# EAGLE design i-oboard (EAGLE 9.6.2)
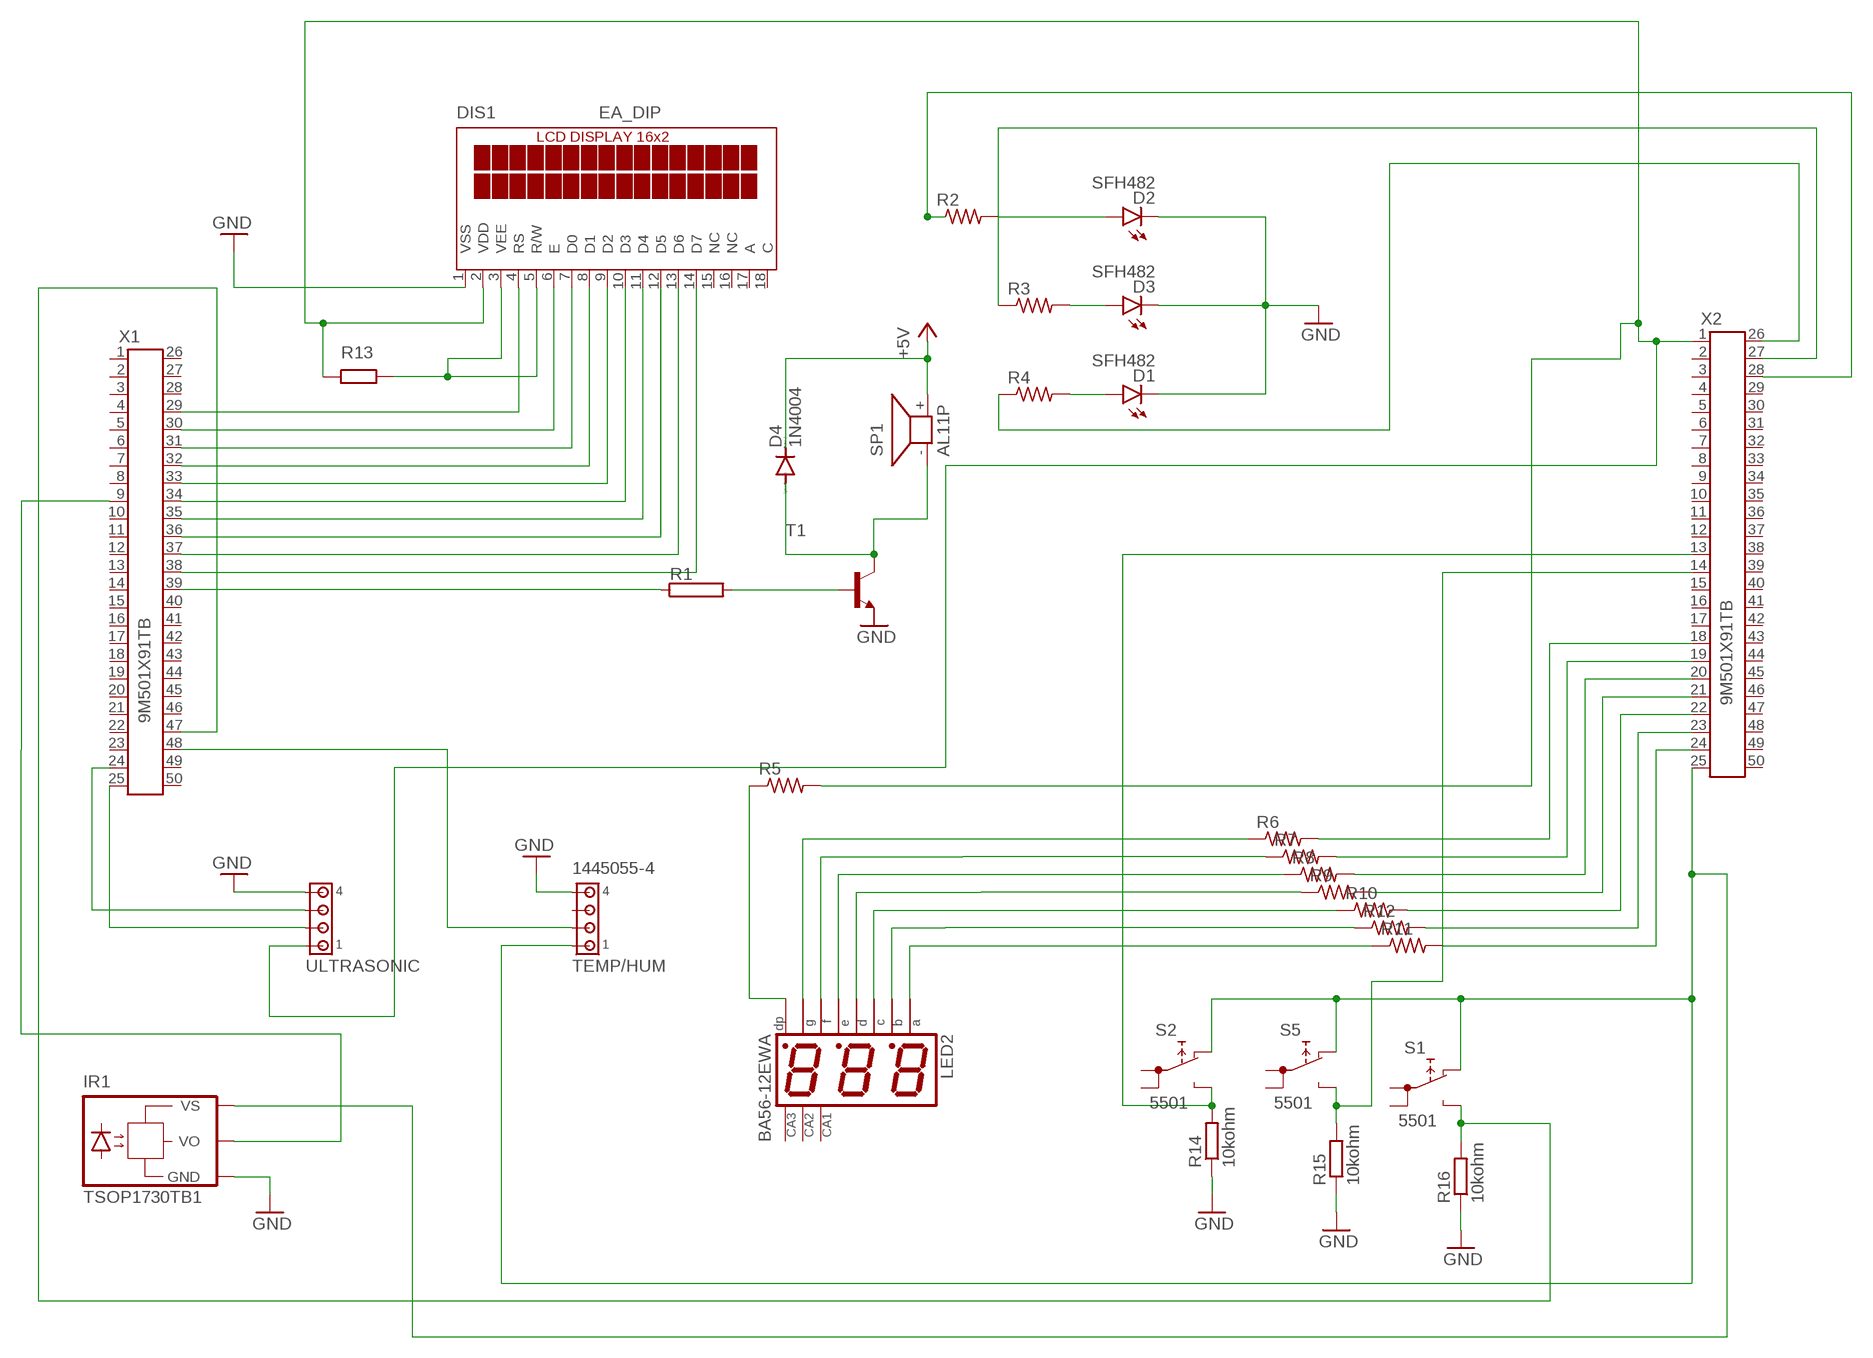
[diagram p0: schematic, sheet 1]

## Parts
D1  SFH482  [SFH482]
D2  SFH482  [SFH482]
D3  SFH482  [SFH482]
D4  1N4004  [DO41-10]
DIS1  EA_DIP  [EA_DIP]
IR1  TSOP1730TB1  [TSOP17_TB1]
LED2  BA56-12EWA  [BX56-12]
R1  RAC01  [AC01]
R2  R-US_0204/2V  [0204V]
R3  R-US_0204/2V  [0204V]
R4  R-US_0204/2V  [0204V]
R5  R-US_0204/2V  [0204V]
R6  R-US_0204/2V  [0204V]
R7  R-US_0204/2V  [0204V]
R8  R-US_0204/2V  [0204V]
R9  R-US_0204/2V  [0204V]
R10  R-US_0204/2V  [0204V]
R11  R-US_0204/2V  [0204V]
R12  R-US_0204/2V  [0204V]
R13  R  (no package)
R14  10kohm  R-EU_0204/2V  [0204V]
R15  10kohm  R-EU_0204/2V  [0204V]
R16  10kohm  R-EU_0204/2V  [0204V]
S1  5501  [5501]
S2  5501  [5501]
S5  5501  [5501]
SP1  AL11P  [AL11P]
T1  -NPN-SOT23-EBC  [SOT23-EBC]
TEMP/HUM  1445055-4  [1445055-4]
ULTRASONIC  1445055-4  [1445055-4]
X1  9M501X91TB  [9M501X91]
X2  9M501X91TB  [9M501X91]

## Nets
+5V: D4.C SP1.+
GND: D1.K(C) D2.K(C) D3.K(C) DIS1.1(VSS) IR1.GND R14.1 R15.1 R16.1 TEMP/HUM.4 ULTRASONIC.4
N$1: LED2.5(G) R6.1
N$2: DIS1.7(D0) X1.31
N$3: DIS1.8(D1) X1.32
N$4: DIS1.9(D2) X1.33
N$5: DIS1.10(D3) X1.34
N$6: DIS1.11(D4) X1.35
N$7: DIS1.12(D5) X1.36
N$8: DIS1.13(D6) X1.37
N$9: D4.A SP1.- T1.C
N$10: DIS1.14(D7) X1.38
N$11: DIS1.6(E) X1.30
N$12: DIS1.4(RS) X1.29
N$13: DIS1.3(VEE) DIS1.5(R/W) R13.2
N$14: R1.2 T1.B
N$15: R1.1 X1.39
N$16: R4.1 X2.26
N$17: R3.1 X2.27
N$18: D2.A R2.2
N$19: D3.A R3.2
N$20: D1.A R4.2
N$21: R11.2 X2.24
N$22: R12.2 X2.23
N$23: R10.2 X2.22
N$24: R9.2 X2.21
N$25: R8.2 X2.20
N$26: R7.2 X2.19
N$27: R6.2 X2.18
N$28: LED2.3(DP) R5.1
N$29: LED2.10(F) R7.1
N$30: ULTRASONIC.2 X1.25
N$31: DIS1.2(VDD) R5.2 R13.1 ULTRASONIC.1 X2.1
N$32: LED2.1(E) R8.1
N$33: LED2.2(D) R9.1
N$34: LED2.4(C) R10.1
N$35: LED2.7(B) R12.1
N$36: LED2.11(A) R11.1
N$37: ULTRASONIC.3 X1.24
N$38: R15.2 S5.NO X2.14
N$39: R2.1 X2.28
N$40: TEMP/HUM.2 X1.48
N$41: IR1.VS S1.NC S2.NC S5.NC TEMP/HUM.1 X2.25
N$42: R14.2 S2.NO X2.13
N$43: R16.2 S1.NO X1.47
N$45: IR1.VO X1.9
Unconnected: DIS1.15(NC) DIS1.16(NC) DIS1.17(A) DIS1.18(C) LED2.8(CA) LED2.9(CA) LED2.12(CA) S1.1A S1.1B S2.1A S2.1B S5.1A S5.1B T1.E TEMP/HUM.3 X1.1 X1.2 X1.3 X1.4 X1.5 X1.6 X1.7 X1.8 X1.10 X1.11 X1.12 X1.13 X1.14 X1.15 X1.16 X1.17 X1.18 X1.19 X1.20 X1.21 X1.22 X1.23 X1.26 X1.27 X1.28 X1.40 X1.41 X1.42 X1.43 X1.44 X1.45 X1.46 X1.49 X1.50 X2.2 X2.3 X2.4 X2.5 X2.6 X2.7 X2.8 X2.9 X2.10 X2.11 X2.12 X2.15 X2.16 X2.17 X2.29 X2.30 X2.31 X2.32 X2.33 X2.34 X2.35 X2.36 X2.37 X2.38 X2.39 X2.40 X2.41 X2.42 X2.43 X2.44 X2.45 X2.46 X2.47 X2.48 X2.49 X2.50

## Library data of the parts
D1-D3 = led:SFH482: IR LED infrared emitting diode, Infineon
D4 = diode:1N4004: DIODE general purpose rectifier, 1 A
DIS1 = display-lcd:EA_DIP: LCD-MODUL 2x16 - 6,68mm, INKL. KONTROLLER HD44780 Source: Data sheet <http://www.lcd-module.de/pdf/doma/dip162-d.pdf>
IR1 = telefunken:TSOP17*TB1: TSOP17..TB1 IR Receiver Modules for Remote Control Systems Source: http://www.vishay.com/docs/82042/82042.pdf; OC_FARNELL: unknown; OC_NEWARK: unknown
LED2 = display-kingbright:B?56-12*WA: 14.22mm (0.56INCH) THREE DIGIT NUMERIC DISPLAY Source: http://www.kingbright.com .. BA56-11EWA(Ver1189474895.pdf; OC_FARNELL: unknown; OC_NEWARK: unknown
R1 = resistor-power:R: Power Resitor; OC_FARNELL: unknown; OC_NEWARK: unknown
R2-R12 = rcl:R-US_: RESISTOR, American symbol; SPICEPREFIX: R
R13 = ngspice-simulation:R: RESISTOR
R14-R16 = rcl:R-EU_: RESISTOR, European symbol; SPICEPREFIX: R
S1 S2 S5 = switch:55?: PUSHBUTTON SERIES 5500 SWITCHES Source: www.e-switch.com .. 5500.pdf
SP1 = buzzer:AL11P: SPEAKER Source: Buerklin; OC_FARNELL: unknown; OC_NEWARK: unknown
T1 = transistor-neu-to92:*-NPN-: NPN Transistror
TEMP/HUM ULTRASONIC = con-amp:1445055-4: Micro MATE-N-LOK Connectors grid 1.5 mm Source: ENG_CD_1445055_A.pdf
X1 X2 = con-3m:9M501X91TB: CONNECTOR PCMCIA-CompactFlash; OC_FARNELL: unknown; OC_NEWARK: unknown

## Board
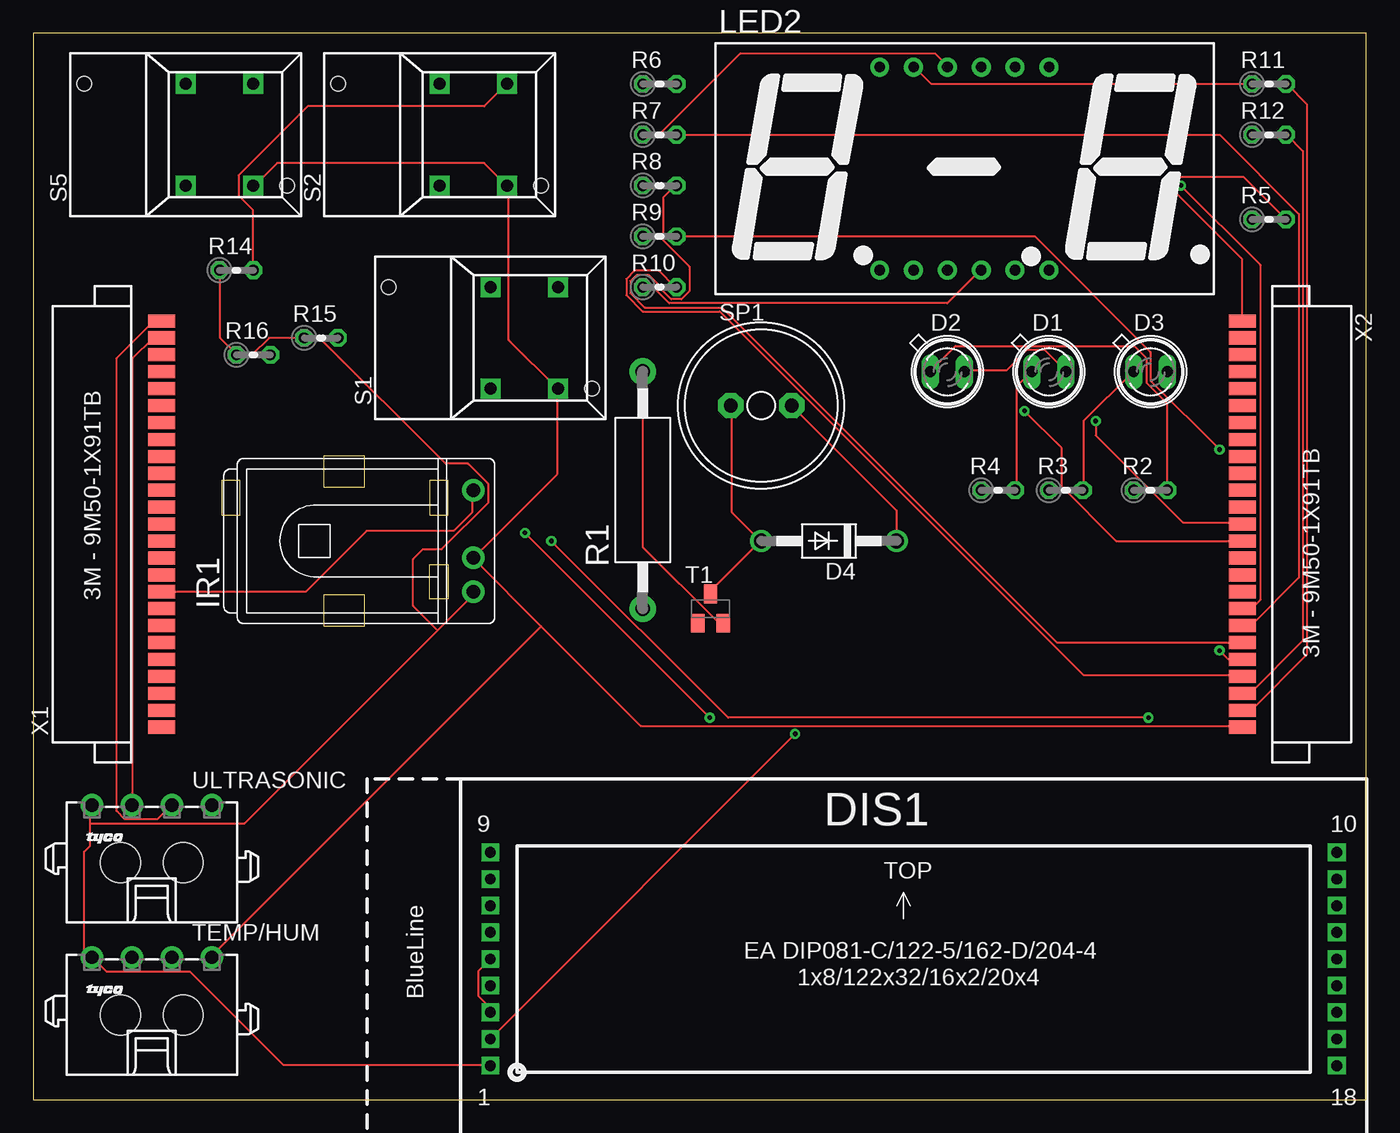
[diagram p1: board, top side]
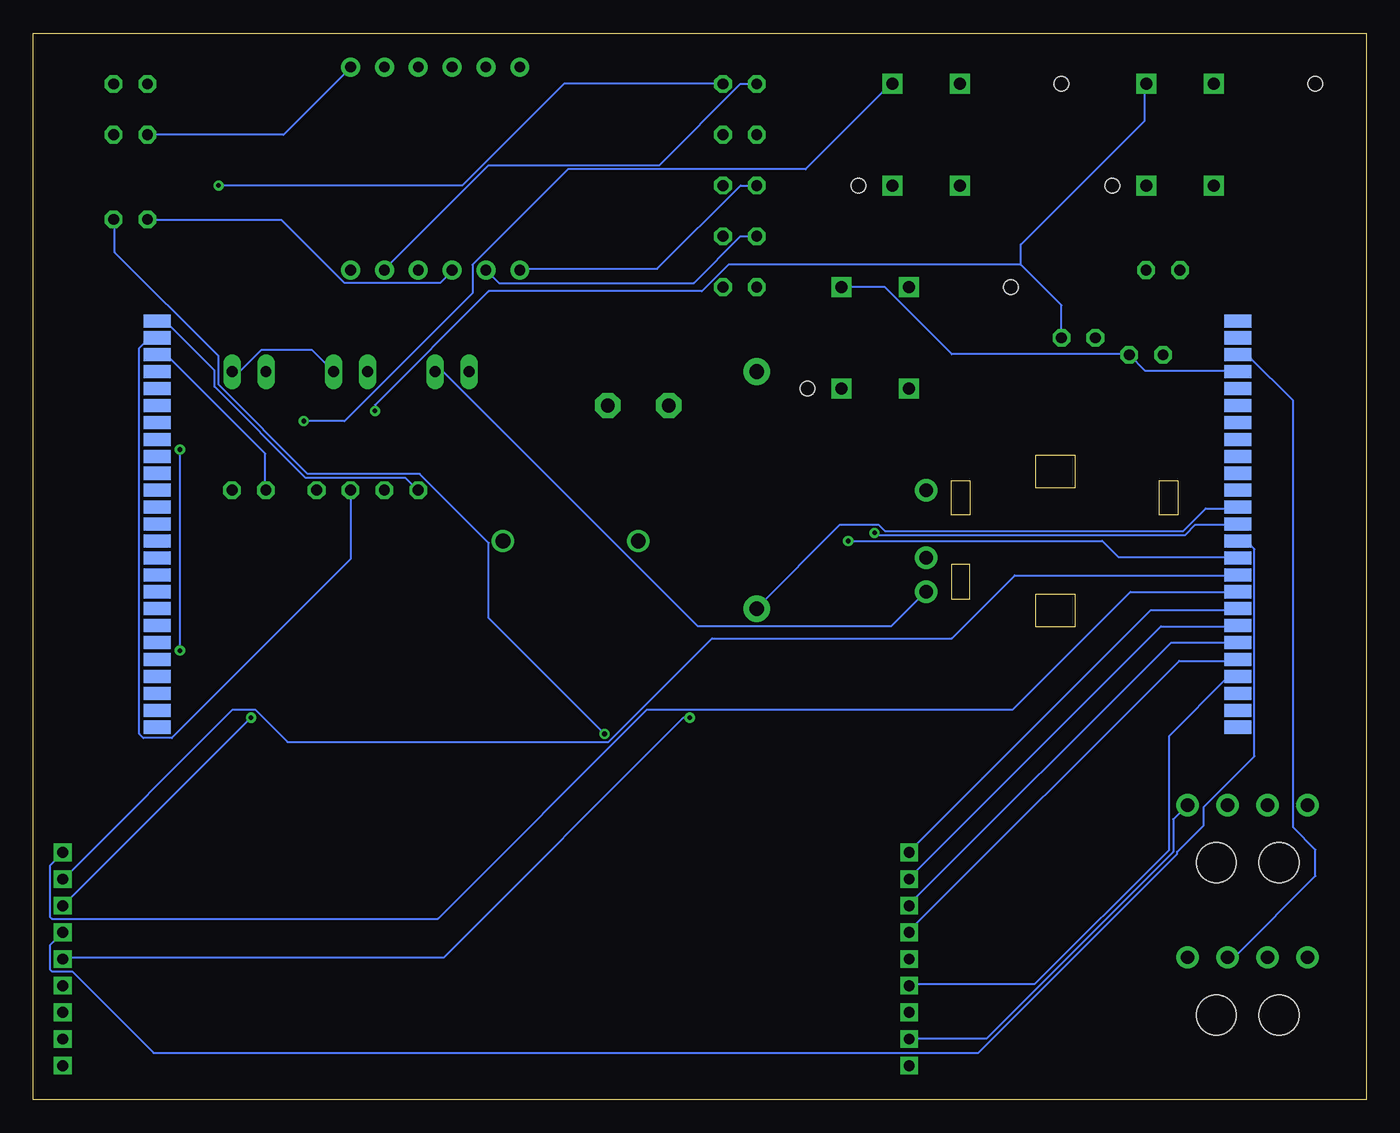
[diagram p2: board, bottom side, seen from below]

Size 100 x 80 mm. Coordinates in mm from the lower left corner, seen from the top.
Outline: 0,0 100,0 100,80 0,80 0,0
Copper layers (1*16): Top 0.035mm / dielectric 1.5mm / Bottom 0.035mm
Design rules "default": minimum track width 6mil, minimum drill 0.35mm, track to track 6mil, track to pad 6mil, pad to pad 6mil, via to via 6mil, smd to smd 6mil, copper to edge 40mil, drill to drill 6mil, minimum pad ring 10mil, minimum via ring 8mil, stop-mask expansion 4mil, vias tented up to drill 0mil, thermal gap 10mil

### Footprints (pad centres in the part's own frame; a part is rotated, then mirrored left to right if it is on the bottom)
SFH482 = drill 0.813 long: A -1.27,0; K 1.27,0
DO41-10 = drill 1.118: A 5.08,0; C -5.08,0
EA_DIP = drill 0.813 pad 1.27 square: 1 0,0; 2 0,2; 3 0,4; 4 0,6; 5 0,8; 6 0,10; 7 0,12; 8 0,14; 9 0,16; 10 63.5,16; 11 63.5,14; 12 63.5,12; 13 63.5,10; 14 63.5,8; 15 63.5,6; 16 63.5,4; 17 63.5,2; 18 63.5,0
TSOP17_TB1 = drill 1 pad 1.676: GND 0,-3.81; VO 0,3.81; VS 0,-1.27
BX56-12 = drill 0.8 pad 1.422: 1 -6.35,-7.62; 2 -3.81,-7.62; 3 -1.27,-7.62; 4 1.27,-7.62; 5 3.81,-7.62; 6 6.35,-7.62; 7 6.35,7.62; 8 3.81,7.62; 9 1.27,7.62; 10 -1.27,7.62; 11 -3.81,7.62; 12 -6.35,7.62
AC01 = drill 1.1 pad 2: 1 -8.9,0; 2 8.9,0
0204V = drill 0.813 octagon: 1 -1.27,0; 2 1.27,0
5501 = drill 0.9 pad 1.5 square: 1A 0,3.81; 1B 0,-3.81; NC 5.08,-3.81; NO 5.08,3.81 | hole 1.1: -7.62,3.81; 7.62,-3.81
AL11P = drill 1.016 pad 1.905 octagon: + 2.286,0; - -2.286,0
SOT23-EBC = smd 1 x 1.4: B 0.95,-1.1; C 0,1.1; E -0.95,-1.1
1445055-4 = drill 1 pad 1.676: 1 4.5,4.32; 2 1.5,4.32; 3 -1.5,4.32; 4 -4.5,4.32 | hole 3: -2.35,0; 2.35,0
9M501X91 = smd 0.98 x 2.03: 1 -15.24,-3.29; 2 -13.97,-3.29; 3 -12.7,-3.29; 4 -11.43,-3.29; 5 -10.16,-3.29; 6 -8.89,-3.29; 7 -7.62,-3.29; 8 -6.35,-3.29; 9 -5.08,-3.29; 10 -3.81,-3.29; 11 -2.54,-3.29; 12 -1.27,-3.29; 13 0,-3.29; 14 1.27,-3.29; 15 2.54,-3.29; 16 3.81,-3.29; 17 5.08,-3.29; 18 6.35,-3.29; 19 7.62,-3.29; 20 8.89,-3.29; 21 10.16,-3.29; 22 11.43,-3.29; 23 12.7,-3.29; 24 13.97,-3.29; 25 15.24,-3.29 | smd 0.98 x 2.03 bottom: 26 -15.24,-3.29; 27 -13.97,-3.29; 28 -12.7,-3.29; 29 -11.43,-3.29; 30 -10.16,-3.29; 31 -8.89,-3.29; 32 -7.62,-3.29; 33 -6.35,-3.29; 34 -5.08,-3.29; 35 -3.81,-3.29; 36 -2.54,-3.29; 37 -1.27,-3.29; 38 0,-3.29; 39 1.27,-3.29; 40 2.54,-3.29; 41 3.81,-3.29; 42 5.08,-3.29; 43 6.35,-3.29; 44 7.62,-3.29; 45 8.89,-3.29; 46 10.16,-3.29; 47 11.43,-3.29; 48 12.7,-3.29; 49 13.97,-3.29; 50 15.24,-3.29

### Placement (x,y rotation side)
D1  76.2,54.61 0 top
D2  68.58,54.61 0 top
D3  83.82,54.61 0 top
D4  59.69,41.91 180 top
DIS1  34.29,2.54 0 top
IR1  33.02,41.91 0 top
LED2  69.85,69.85 0 top
R1  45.72,45.72 90 top
R2  83.82,45.72 0 top
R3  77.47,45.72 0 top
R4  72.39,45.72 0 top
R5  92.71,66.04 0 top
R6  46.99,76.2 0 top
R7  46.99,72.39 0 top
R8  46.99,68.58 0 top
R9  46.99,64.77 0 top
R10  46.99,60.96 0 top
R11  92.71,76.2 0 top
R12  92.71,72.39 0 top
R14  15.24,62.23 0 top
R15  21.59,57.15 0 top
R16  16.51,55.88 0 top
S1  34.29,57.15 0 top
S2  30.48,72.39 0 top
S5  11.43,72.39 0 top
SP1  54.61,52.07 0 top
T1  50.8,36.83 0 top
TEMP/HUM  8.89,6.35 0 top
ULTRASONIC  8.89,17.78 0 top
X1  6.35,43.18 90 top
X2  93.98,43.18 270 top

### Tracks (layer width: path | path; a pad name or v marks a point on that pad's centre or on a via)
+5V
  Top 0.152: D4.C 64.77,44.2 SP1.+
GND
  Top 0.152: D2.K 69.95,54.71 73,54.71 74.52,56.24 75.89,56.24 77.42,54.71 D1.K | 15.24,55.93 16.46,55.93 17.68,57.15 R15.1 21.49,57.15 30.94,47.7 32.61,47.7 34.14,46.18 34.14,44.81 30.63,41.3 29.26,41.3 28.5,40.54 28.5,37.03 30.33,35.2 | 15.24,55.93 14.02,57.15 14.02,62.18 R14.1 | 15.24,55.93 R16.1 | DIS1.1 34.29,2.59 18.75,2.59 11.73,9.6 5.49,9.6 4.42,10.67 TEMP/HUM.4 4.27,10.82 3.81,11.28 3.81,18.59 4.27,19.05 4.27,20.73 | 4.27,20.73 4.27,22.1 ULTRASONIC.4 | 30.33,35.2 15.85,20.73 4.27,20.73 | 30.33,35.2 32.92,37.8 32.92,38.1 IR1.GND
  Bottom 0.152: D1.K 79.1,56.24 82.91,56.24 84.43,54.71 85.04,54.71 D3.K | D2.K 69.8,54.56 69.19,54.56 50.14,35.51 35.66,35.51 33.07,38.1 IR1.GND
N$1
  Bottom 0.152: R6.1 46.94,76.2 53.03,70.1 65.84,70.1 73.61,62.33 LED2.5
N$2
  Bottom 0.152: X1.31 14.63,34.29 34.29,14.63 DIS1.7
N$3
  Bottom 0.152: X1.32 9.75,35.51 15.39,35.51 34.29,16.61 DIS1.8
N$4
  Bottom 0.152: X1.33 9.75,36.73 16.15,36.73 34.29,18.59 DIS1.9
N$5
  Bottom 0.152: X1.34 17.68,38.1 26.52,29.26 53.95,29.26 69.65,13.56 98.6,13.56 98.75,13.72 98.75,17.53 97.84,18.44 DIS1.10
N$6
  Bottom 0.152: X1.35 9.75,39.32 26.36,39.32 31.09,34.59 49.07,34.59 56.84,26.82 80.92,26.82 83.36,29.26 85.04,29.26 97.69,16.61 DIS1.11
N$7  (via drill 0.35)
  Top 0.152: v38.86,41.91 52.12,28.65 v83.67,28.65
  Bottom 0.152: v38.86,41.91 19.81,41.91 18.59,40.69 9.75,40.69 X1.36 | v83.67,28.65 97.69,14.63 DIS1.12
N$8
  Bottom 0.152: X1.37 8.99,41.91 8.38,41.3 8.38,25.76 12.19,21.95 12.19,20.57 14.17,18.59 14.17,18.44 29.11,3.5 90.98,3.5 97.08,9.6 98.6,9.6 98.75,9.75 98.75,11.58 97.84,12.5 DIS1.13
N$9
  Top 0.152: 54.56,41.91 50.9,38.25 50.9,37.95 T1.C | 54.56,41.91 52.43,44.04 52.43,51.97 SP1.- | 54.56,41.91 D4.A
N$10  (via drill 0.35)
  Top 0.152: v50.75,28.65 v36.88,42.52
  Bottom 0.152: v36.88,42.52 36.73,42.37 13.56,42.37 12.8,43.13 9.75,43.13 X1.38 | v50.75,28.65 51.21,28.65 69.19,10.67 97.69,10.67 DIS1.14
N$11
  Bottom 0.152: X1.30 9.75,32.92 14.02,32.92 34.29,12.65 DIS1.6
N$12
  Bottom 0.152: X1.29 9.75,31.7 10.36,31.7 14.78,27.28 14.78,18.75 24.84,8.69 34.29,8.69 DIS1.4
N$13
  Top 0.152: DIS1.3 34.29,6.86 33.38,7.77 33.38,9.6 34.29,10.52 DIS1.5
N$14
  Top 0.152: R1.2 45.72,41.45 51.36,35.81 51.66,35.81 T1.B
N$15
  Bottom 0.152: X1.39 9.75,44.35 12.04,44.35 13.72,42.67 36.12,42.67 36.58,43.13 39.47,43.13 45.72,36.88 R1.1
N$16
  Bottom 0.152: X2.26 90.68,58.37 90.07,58.37 86.41,54.71 86.41,53.49 79.55,46.63 72.08,46.63 71.17,45.72 R4.1
N$17
  Bottom 0.152: X2.27 91.29,57.15 92.05,56.39 92.05,27.43 91.75,27.13 89.61,27.13 76.2,40.54 R3.1
N$18
  Top 0.152: R2.2 85.04,45.72 85.04,52.27 83.52,53.8 83.52,55.63 82.6,56.54 69.19,56.54 67.36,54.71 D2.A
N$19
  Top 0.152: R3.2 78.79,45.72 78.79,50.9 82.45,54.56 D3.A
N$20
  Top 0.152: R4.2 73.76,45.72 73.76,53.49 74.83,54.56 D1.A
N$21
  Top 0.152: X2.24 90.83,29.26 91.44,29.26 95.56,33.38 95.56,74.68 94.03,76.2 R11.2
N$22
  Top 0.152: X2.23 91.29,30.48 95.25,34.44 95.25,71.17 94.03,72.39 R12.2
N$23
  Top 0.152: X2.22 90.68,31.85 78.79,31.85 51.51,59.13 45.72,59.13 44.5,60.35 44.5,61.57 45.11,62.18 46.94,62.18 48.16,60.96 R10.2
N$24  (via drill 0.35)
  Top 0.152: v89,33.68 89.61,33.07 90.68,33.07 X2.21 | v89,48.77 83.82,53.95 83.82,56.08 75.13,64.77 R9.2
  Bottom 0.152: v89,48.77 v89,33.68
N$25
  Top 0.152: X2.20 76.81,34.29 51.66,59.44 45.87,59.44 44.81,60.5 44.81,61.42 45.26,61.87 46.18,61.87 47.24,60.81 47.24,60.66 47.85,60.05 48.62,60.05 49.23,60.66 49.23,62.48 47.24,64.47 47.24,67.67 48.16,68.58 R8.2
N$26
  Top 0.152: R7.2 89,72.39 94.94,66.45 94.94,39.17 91.44,35.66 90.83,35.66 X2.19
N$27  (via drill 0.35)
  Top 0.152: v86.11,68.58 92.05,62.64 92.05,37.49 91.44,36.88 90.83,36.88 X2.18
  Bottom 0.152: v86.11,68.58 67.82,68.58 60.2,76.2 R6.2
N$28
  Bottom 0.152: R5.1 91.44,65.99 81.38,65.99 76.66,61.27 69.49,61.27 68.58,62.18 LED2.3
N$29
  Top 0.152: R7.1 46.94,72.39 53.03,78.49 67.67,78.49 68.58,77.57 LED2.10
N$30
  Top 0.152: X1.25 9.6,58.37 8.99,58.37 6.25,55.63 6.25,21.64 6.86,21.03 9.3,21.03 10.36,22.1 ULTRASONIC.2
N$31  (via drill 0.35)
  Top 0.152: R5.2 90.83,69.19 85.8,69.19 85.5,68.89 85.5,68.28 90.68,63.09 90.68,58.52 X2.1 | v57.15,27.43 34.29,4.57 DIS1.2
  Bottom 0.152: DIS1.2 34.29,4.57 28.5,4.57 14.48,18.59 14.48,21.03 13.41,22.1 ULTRASONIC.1 | v57.15,27.43 65.84,36.12 65.84,41.76 71.02,46.94 79.4,46.94 86.11,53.65 86.11,55.78 93.88,63.55 93.88,65.99 R5.2
N$32
  Bottom 0.152: R8.1 46.94,68.58 53.19,62.33 63.4,62.33 LED2.1
N$33
  Bottom 0.152: R9.1 46.94,64.77 50.44,61.27 65.08,61.27 LED2.2
N$34
  Top 0.152: R10.1 46.48,60.96 47.7,59.74 68.58,59.74 71.02,62.18 LED2.4
N$35
  Bottom 0.152: R12.1 81.23,72.39 76.2,77.42 LED2.7
N$36
  Top 0.152: R11.1 67.36,76.2 66.14,77.42 LED2.11
N$37
  Top 0.152: X1.24 8.99,57.15 7.47,55.63 7.47,22.25 ULTRASONIC.3
N$38  (via drill 0.35)
  Top 0.152: X2.14 81.23,41.91 77.11,46.02 77.11,48.92 v74.37,51.66
  Bottom 0.152: v74.37,51.66 74.37,52.12 65.84,60.66 49.84,60.66 47.85,62.64 25.91,62.64 | 25.91,62.64 22.86,59.59 R15.2 | 25.91,62.64 25.91,64.16 16.61,73.46 16.61,76.2 S5.NO
N$39
  Bottom 0.152: X2.28 90.68,55.78 89.92,55.78 82.6,48.46 82.6,45.72 R2.1
N$40
  Bottom 0.152: X1.48 9.6,55.78 8.84,55.78 5.49,52.43 5.49,20.42 3.81,18.75 3.81,16.76 9.75,10.82 10.36,10.82 TEMP/HUM.2
N$41
  Top 0.152: S5.NC 16.61,68.58 18.29,70.26 33.83,70.26 35.51,68.58 S2.NC 35.66,68.58 35.66,57 39.32,53.34 | 38.1,35.51 33.07,40.54 IR1.VS 39.32,46.94 39.32,53.34 | 38.1,35.51 45.57,28.04 90.68,28.04 X2.25 | 38.1,35.51 13.41,10.82 TEMP/HUM.1 | 39.32,53.34 S1.NC
N$42  (via drill 0.35)
  Top 0.152: v79.7,50.9 79.7,49.84 86.26,43.28 90.68,43.28 X2.13 | R14.2 16.46,62.33 16.46,66.75 15.39,67.82 15.39,69.34 20.57,74.52 33.83,74.52 35.51,76.2 S2.NO
  Bottom 0.152: v79.7,50.9 76.66,50.9 67.06,60.5 67.06,62.64 59.89,69.8 42.06,69.8 35.66,76.2 S2.NO
N$43
  Bottom 0.152: X1.47 9.75,54.71 16.61,54.71 R16.2 17.83,55.93 31.09,55.93 36.12,60.96 S1.NO
N$45
  Top 0.152: X1.9 20.42,38.1 24.99,42.67 31.55,42.67 32.92,44.04 32.92,45.72 IR1.VO